# Altium schematic sheet Guppy.SchDoc: Top Sheet
size A3; Author: Tim Vrakas; CompanyName: SSI; Revision: 2.1; SheetNumber: 1; SheetTotal: 6; DocumentName: Top Sheet
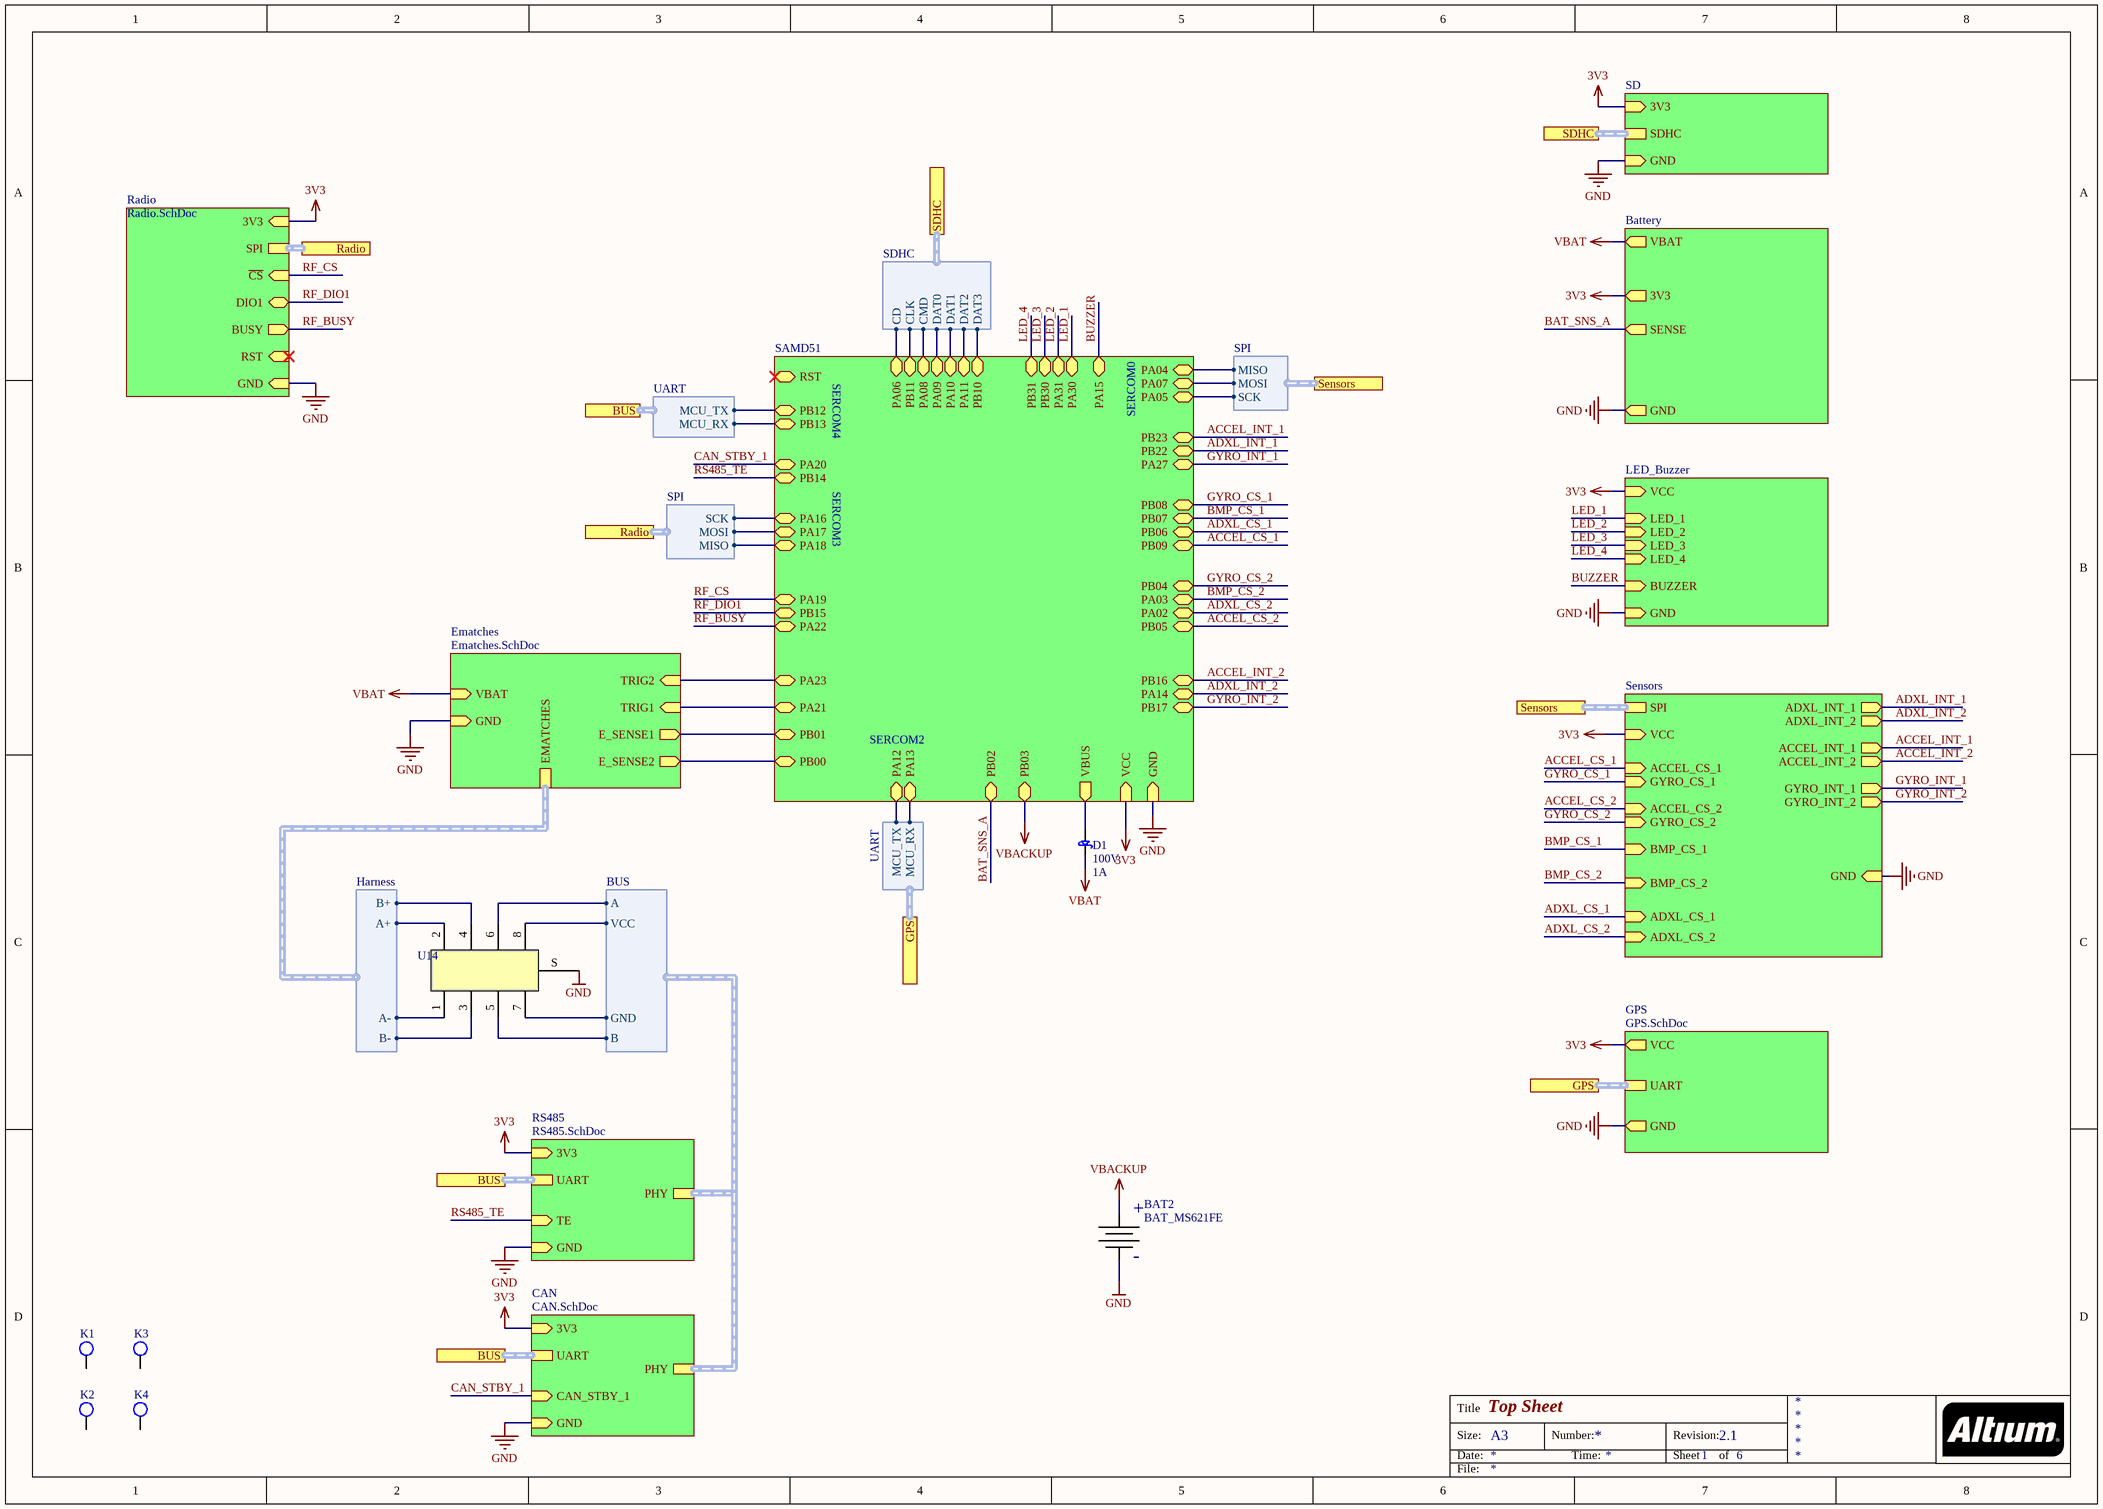
[diagram p0: Guppy.SchDoc]

## Parts
BAT2  BAT_MS621FE  [BATT_COINCELL_RECHARGEABLE]
D1  Voltage - DC Reverse (Vr) (Max): 100V  Current - Average Rectified (Io): 1A  [SMA]  (hidden comment: Diode_CD214A-B1100LF)
K1  #4_PRESSFIT_MOUNTING_FOOT  [#4_PRESSFIT_FOOT_1/4]  (value not drawn)
K2  #4_PRESSFIT_MOUNTING_FOOT  [#4_PRESSFIT_FOOT_1/4]  (value not drawn)
K3  #4_PRESSFIT_MOUNTING_FOOT  [#4_PRESSFIT_FOOT_1/4]  (value not drawn)
K4  #4_PRESSFIT_MOUNTING_FOOT  [#4_PRESSFIT_FOOT_1/4]  (value not drawn)
U14  CONN 2x4 HARWIN M80-5S20805MD  [M80-5S20805MD]  (value not drawn)

## Sub-sheets
Battery = Battery_Management: SENSE (out), GND (out), 3V3 (out), VBAT (out)
CAN = CAN.SchDoc: 3V3 (in), GND (in), UART (harness UART), CAN_STBY_1 (in), PHY (harness BUS)
Ematches = Ematches.SchDoc: E_SENSE1 (out), E_SENSE2 (out), TRIG2 (in), TRIG1 (in), VBAT (in), GND (in), EMATCHES (harness Harness)
GPS = GPS.SchDoc: UART (harness UART), VCC (out), GND (out)
LED_Buzzer = Blink_Blink_Beep_Boop: LED_1 (in), LED_2 (in), LED_3 (in), LED_4 (in), BUZZER (in), GND (in), VCC (in)
Radio = Radio.SchDoc: RST (in), SPI (harness SPI), ~{CS} (in), DIO1 (bidir), BUSY (out), 3V3 (in), GND (in)
RS485 = RS485.SchDoc: 3V3 (in), GND (in), UART (harness UART), TE (in), PHY (harness BUS)
SAMD51 = SAMD51.SchDoc: PA12 (bidir), PA13 (bidir), PA05 (bidir), PA07 (bidir), PA04 (bidir), PA06 (bidir), PB11 (bidir), PA08 (bidir), PA09 (bidir), PA10 (bidir), PA11 (bidir), PB10 (bidir), PB12 (bidir), PB13 (bidir), PA22 (bidir), PA23 (bidir), PA19 (bidir), PA17 (bidir), PA20 (bidir), PA21 (bidir), PB08 (bidir), PB07 (bidir), PB06 (bidir), PB09 (bidir), PB04 (bidir), PA03 (bidir), PA02 (bidir), PB05 (bidir), PB00 (bidir), PB30 (bidir), PA31 (bidir), PA30 (bidir), PB31 (bidir), PB16 (bidir), PA14 (bidir), PB17 (bidir), PB23 (bidir), PB22 (bidir), PA27 (bidir), PB02 (bidir), PB01 (bidir), PB03 (bidir), PA18 (bidir), GND (in), VCC (in), VBUS (out), PB14 (bidir), PB15 (bidir), PA15 (bidir), RST (bidir), PA16 (bidir)
SD = SD.SchDoc: SDHC (harness SDHC), GND (in), 3V3 (in)
Sensors = Sensors.SchDoc: SPI (harness SPI), GYRO_CS_1 (in), BMP_CS_1 (in), ADXL_CS_1 (in), ACCEL_CS_1 (in), ACCEL_INT_1 (out), ACCEL_INT_2 (out), ADXL_INT_1 (out), GYRO_INT_1 (out), GYRO_INT_2 (out), GND (in), VCC (in), GYRO_CS_2 (in), ACCEL_CS_2 (in), BMP_CS_2 (in), ADXL_CS_2 (in), ADXL_INT_2 (out)

## Ports
BUS (harness UART), GPS (harness UART), Radio (harness SPI), SDHC (harness SDHC), Sensors (harness SPI)

## Harnesses
UART: MCU_TX, MCU_RX
SPI: MISO, MOSI, SCK
SDHC: CD, CLK, CMD, DAT0, DAT1, DAT2, DAT3
Harness: A+, A-, B+, B-
BUS: VCC, A, B, GND
UART: MCU_RX, MCU_TX

## Nets
3V3: sheet Sensors/VCC, sheet Battery/3V3, sheet LED_Buzzer/VCC, sheet SAMD51/VCC, sheet SD/3V3, sheet GPS/VCC, sheet RS485/3V3, sheet CAN/3V3, sheet Radio/3V3
GND: BAT2.- U14.S ; sheet Sensors/GND, sheet Battery/GND, sheet LED_Buzzer/GND, sheet SAMD51/GND, sheet SD/GND, sheet GPS/GND, sheet Ematches/GND, sheet RS485/GND, sheet CAN/GND, sheet Radio/GND
VBACKUP: BAT2.+ ; sheet SAMD51/PB03
VBAT: D1.2(Cathode) ; sheet Battery/VBAT, sheet Ematches/VBAT
ACCEL_CS_1: sheet Sensors/ACCEL_CS_1, sheet SAMD51/PB09
ACCEL_CS_2: sheet Sensors/ACCEL_CS_2, sheet SAMD51/PB05
ACCEL_INT_1: sheet Sensors/ACCEL_INT_1, sheet SAMD51/PB23
ACCEL_INT_2: sheet Sensors/ACCEL_INT_2, sheet SAMD51/PB16
ADXL_CS_1: sheet Sensors/ADXL_CS_1, sheet SAMD51/PB06
ADXL_CS_2: sheet Sensors/ADXL_CS_2, sheet SAMD51/PA02
ADXL_INT_1: sheet Sensors/ADXL_INT_1, sheet SAMD51/PB22
ADXL_INT_2: sheet Sensors/ADXL_INT_2, sheet SAMD51/PA14
BAT_SNS_A: sheet Battery/SENSE, sheet SAMD51/PB02
BMP_CS_1: sheet Sensors/BMP_CS_1, sheet SAMD51/PB07
BMP_CS_2: sheet Sensors/BMP_CS_2, sheet SAMD51/PA03
BUZZER: sheet LED_Buzzer/BUZZER, sheet SAMD51/PA15
CAN_STBY_1: sheet SAMD51/PA20, sheet CAN/CAN_STBY_1
GYRO_CS_1: sheet Sensors/GYRO_CS_1, sheet SAMD51/PB08
GYRO_CS_2: sheet Sensors/GYRO_CS_2, sheet SAMD51/PB04
GYRO_INT_1: sheet Sensors/GYRO_INT_1, sheet SAMD51/PA27
GYRO_INT_2: sheet Sensors/GYRO_INT_2, sheet SAMD51/PB17
LED_1: sheet LED_Buzzer/LED_1, sheet SAMD51/PA30
LED_2: sheet LED_Buzzer/LED_2, sheet SAMD51/PA31
LED_3: sheet LED_Buzzer/LED_3, sheet SAMD51/PB30
LED_4: sheet LED_Buzzer/LED_4, sheet SAMD51/PB31
RF_BUSY: sheet SAMD51/PA22, sheet Radio/BUSY
RF_CS: sheet SAMD51/PA19, sheet Radio/~{CS}
RF_DIO1: sheet SAMD51/PB15, sheet Radio/DIO1
RS485_TE: sheet SAMD51/PB14, sheet RS485/TE
NetD1_1: D1.1(Anode) ; sheet SAMD51/VBUS
NetU14_1: U14.1 ; sheet Ematches/EMATCHES.A-
NetU14_2: U14.2 ; sheet Ematches/EMATCHES.A+
NetU14_3: U14.3 ; sheet Ematches/EMATCHES.B-
NetU14_4: U14.4 ; sheet Ematches/EMATCHES.B+
NetU14_5: U14.5 ; sheet RS485/PHY.B
NetU14_6: U14.6 ; sheet RS485/PHY.A
NetU14_7: U14.7 ; sheet RS485/PHY.GND
NetU14_8: U14.8 ; sheet RS485/PHY.VCC
(unnamed): sheet SAMD51/PA12, port GPS.MCU_TX
(unnamed): sheet SAMD51/PA13, port GPS.MCU_RX
(unnamed): sheet SAMD51/PA05, port Sensors.SCK
(unnamed): sheet SAMD51/PA07, port Sensors.MOSI
(unnamed): sheet SAMD51/PA04, port Sensors.MISO
(unnamed): sheet SAMD51/PA06, port SDHC.CD
(unnamed): sheet SAMD51/PB11, port SDHC.CLK
(unnamed): sheet SAMD51/PA08, port SDHC.CMD
(unnamed): sheet SAMD51/PA09, port SDHC.DAT0
(unnamed): sheet SAMD51/PA10, port SDHC.DAT1
(unnamed): sheet SAMD51/PA11, port SDHC.DAT2
(unnamed): sheet SAMD51/PB10, port SDHC.DAT3
(unnamed): sheet SAMD51/PB12, port BUS.MCU_TX
(unnamed): sheet SAMD51/PB13, port BUS.MCU_RX
(unnamed): sheet SAMD51/PA23, sheet Ematches/TRIG2
(unnamed): sheet SAMD51/PA17, port Radio.MOSI
(unnamed): sheet SAMD51/PA21, sheet Ematches/TRIG1
(unnamed): sheet SAMD51/PB00, sheet Ematches/E_SENSE2
(unnamed): sheet SAMD51/PB01, sheet Ematches/E_SENSE1
(unnamed): sheet SAMD51/PA18, port Radio.MISO
(unnamed): sheet SAMD51/PA16, port Radio.SCK

Not connected (* = marked no-connect by the designer): K1 1; K2 1; K3 1; K4 1

## Buses and harness runs
harness port BUS = sheet CAN/UART
harness port BUS = sheet RS485/UART
harness port GPS = sheet GPS/UART
harness port Radio = sheet Radio/SPI
harness port SDHC = sheet SD/SDHC
harness port Sensors = sheet Sensors/SPI
harness sheet CAN/PHY = sheet RS485/PHY

## Notes on the sheet
- SERCOM4
- SERCOM0
- SERCOM3
- SERCOM2
- Title
- Size:
- Date:
- A3
- Number:
- Time:
- Revision:
- Sheet
- of
- File:

## Library data of the parts
BAT2 = CMP-060-0000-1: MS621FE RECHARGEABLE COIN CELL BACKUP; Manufacturer: Seiko Instruments; Manufacturer Part Number: MS621FE-FL11E; Battery Chemistry: Lithium; Battery Cell Size: Coin, 6.8mm; Capacity: 5.5mAh; Discharge Rate: 15µA; Shipping Info: Due to restrictions, only ground shipment is allowed.; RoHS: RoHS Compliant; Stock 1: 41059; Pricing 1: 1=2.04, 10=1.838, 50=1.6338, 100=1.4296, 250=1.30704, 500=1.22534, 1000=1.09051, 2500=1.0112, 5000=0.99138 (USD); Part Status: Active; Size / Dimension: 0.27" Dia x 0.08" H (6.8mm x 2.1mm); Termination Style: SMD (SMT) Tab; Standard Charge Current: 15µA; Standard Charge Time: -; Weight: 0.23g; ComponentLink1URL: http://www.sii.co.jp/en/me/files/2017/04/MicroBatteryCatalogue-E_2017_web.pdf; ComponentLink1Description: http://www.sii.co.jp/en/me/files/2017/04/MicroBatteryCatalogue-E_2017_web.pdf; Design Item ID: BAT_MS621FE; Source: miscellaneous.SchLib
D1 = CMP-033-0060-1: Diode Schottky 100V 1A Surface Mount SMA (DO-214AC); Manufacturer: Bourns Inc.; Voltage - Forward (Vf) (Max) @ If: 790mV @ 1A; Current - Reverse Leakage @ Vr: 500µA @ 100V; Speed: Fast Recovery =< 500ns, > 200mA (Io); Capacitance @ Vr, F: 30pF @ 4V, 1MHz; Design Item ID: Diode_CD214A-B1100LF; Part Status: Active; Source: diode.SchLib; Stock 1: 21982; Manufacturer Part Number: CD214A-B1100LF; Diode Type: Schottky; Reverse Recovery Time (trr): -; Operating Temperature - Junction: -55°C ~ 125°C; RoHS: RoHS Compliant; Supplier Device Package: SMA (DO-214AC); Package / Case: DO-214AC, SMA; Packaging: Cut Tape (CT); ComponentLink1Description: http://www.bourns.com/docs/Product-Datasheets/CD214-B120_B1100.pdf; Mounting Type: Surface Mount; Pricing 1: 1=0.54, 10=0.42, 25=0.3544, 100=0.2888, 250=0.2392, 500=0.1976, 1000=0.148, 2500=0.136 (USD); ComponentLink1URL: http://www.bourns.com/docs/Product-Datasheets/CD214-B120_B1100.pdf
K1-K4 = CMP-054-0013-1: Press-Fit Unthreaded Spacers, 7/32" OD, 1/8" Long; Supplier Link: https://www.mcmaster.com/#92985a610/=16cb2ec; Design Item ID: #4_PRESSFIT_MOUNTING_FOOT; Source: mechanical.SchLib
U14 = CMP-030-0082-1: Design Item ID: CONN 2x4 HARWIN M80-5S20805MD; Source: connector.SchLib